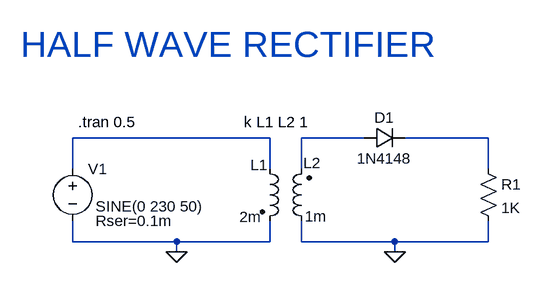
[diagram p0: schematic HALF_WAVE.asc]
HALF_WAVE.asc, the LTspice schematic file:
Version 4
SHEET 1 880 680
WIRE 256 64 -48 64
WIRE 400 64 304 64
WIRE 592 64 464 64
WIRE -48 112 -48 64
WIRE 256 112 256 64
WIRE 304 112 304 64
WIRE 592 112 592 64
WIRE -48 224 -48 192
WIRE 112 224 -48 224
WIRE 256 224 256 192
WIRE 256 224 112 224
WIRE 304 224 304 192
WIRE 448 224 304 224
WIRE 592 224 592 192
WIRE 592 224 448 224
WIRE 112 240 112 224
WIRE 448 240 448 224
FLAG 448 240 0
FLAG 112 240 0
SYMBOL ind2 240 96 R0
WINDOW 0 -14 10 Left 2
WINDOW 3 -31 90 Left 2
SYMATTR InstName L1
SYMATTR Value 2m
SYMATTR Type ind
SYMBOL ind2 320 208 R180
WINDOW 0 -14 105 Left 2
WINDOW 3 -23 23 Left 2
SYMATTR InstName L2
SYMATTR Value 1m
SYMATTR Type ind
SYMBOL diode 400 80 R270
WINDOW 0 32 32 VTop 2
WINDOW 3 0 32 VBottom 2
SYMATTR InstName D1
SYMATTR Value 1N4148
SYMBOL res 576 96 R0
SYMATTR InstName R1
SYMATTR Value 1K
SYMBOL voltage -48 96 R0
WINDOW 3 35 74 Left 2
WINDOW 123 0 0 Left 0
WINDOW 39 35 96 Left 2
SYMATTR Value SINE(0 230 50)
SYMATTR SpiceLine Rser=0.1m
SYMATTR InstName V1
TEXT 216 40 Left 2 !k L1 L2 1
TEXT -40 40 Left 2 !.tran 0.5
TEXT -128 -80 Left 5 ;HALF WAVE RECTIFIER

The netlist it stands for:
* HALF_WAVE.asc
L1 N001 0 2m
L2 0 N002 1m
D1 N002 N003 1N4148
R1 N003 0 1K
V1 N001 0 SINE(0 230 50) Rser=0.1m
.model D D
.lib standard.dio
k L1 L2 1
.tran 0.5
* HALF WAVE RECTIFIER
.backanno
.end